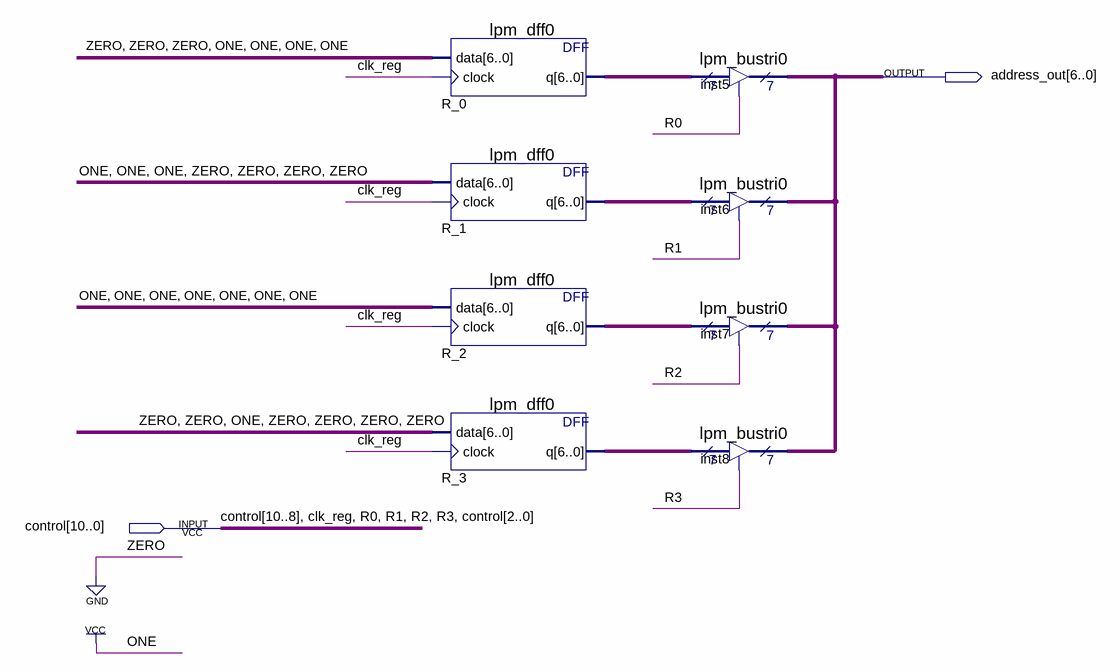
[diagram p0: schematic sheet]
// Quartus schematic Reg.bdf as structural Verilog: 8 symbols, 2 pins
module Reg (
  input  [10:0] control,
  output [6:0] address_out
);

  wire [6:0] R_0_q, R_1_q, R_2_q, R_3_q;

  lpm_dff0 R_0 (.data(7'b0001111), .clock(control[7]), .q(R_0_q));
  lpm_dff0 R_1 (.data(7'b1110000), .clock(control[7]), .q(R_1_q));
  lpm_dff0 R_2 (.data({7{1'b1}}), .clock(control[7]), .q(R_2_q));
  lpm_dff0 R_3 (.data(7'b0010000), .clock(control[7]), .q(R_3_q));
  lpm_bustri0 inst5 (.enabledt(control[6]), .data(R_0_q), .tridata(address_out));
  lpm_bustri0 inst6 (.enabledt(control[5]), .data(R_1_q), .tridata(address_out));
  lpm_bustri0 inst7 (.enabledt(control[4]), .data(R_2_q), .tridata(address_out));
  lpm_bustri0 inst8 (.enabledt(control[3]), .data(R_3_q), .tridata(address_out));

  // Other names for the same wires on the sheet: clk_reg = control[7]; R0 = control[6]; R1 = control[5];
  //   R2 = control[4]; R3 = control[3]
endmodule
